# EAGLE design PSU-triple-voltage-eagle-6 (EAGLE 6.2)
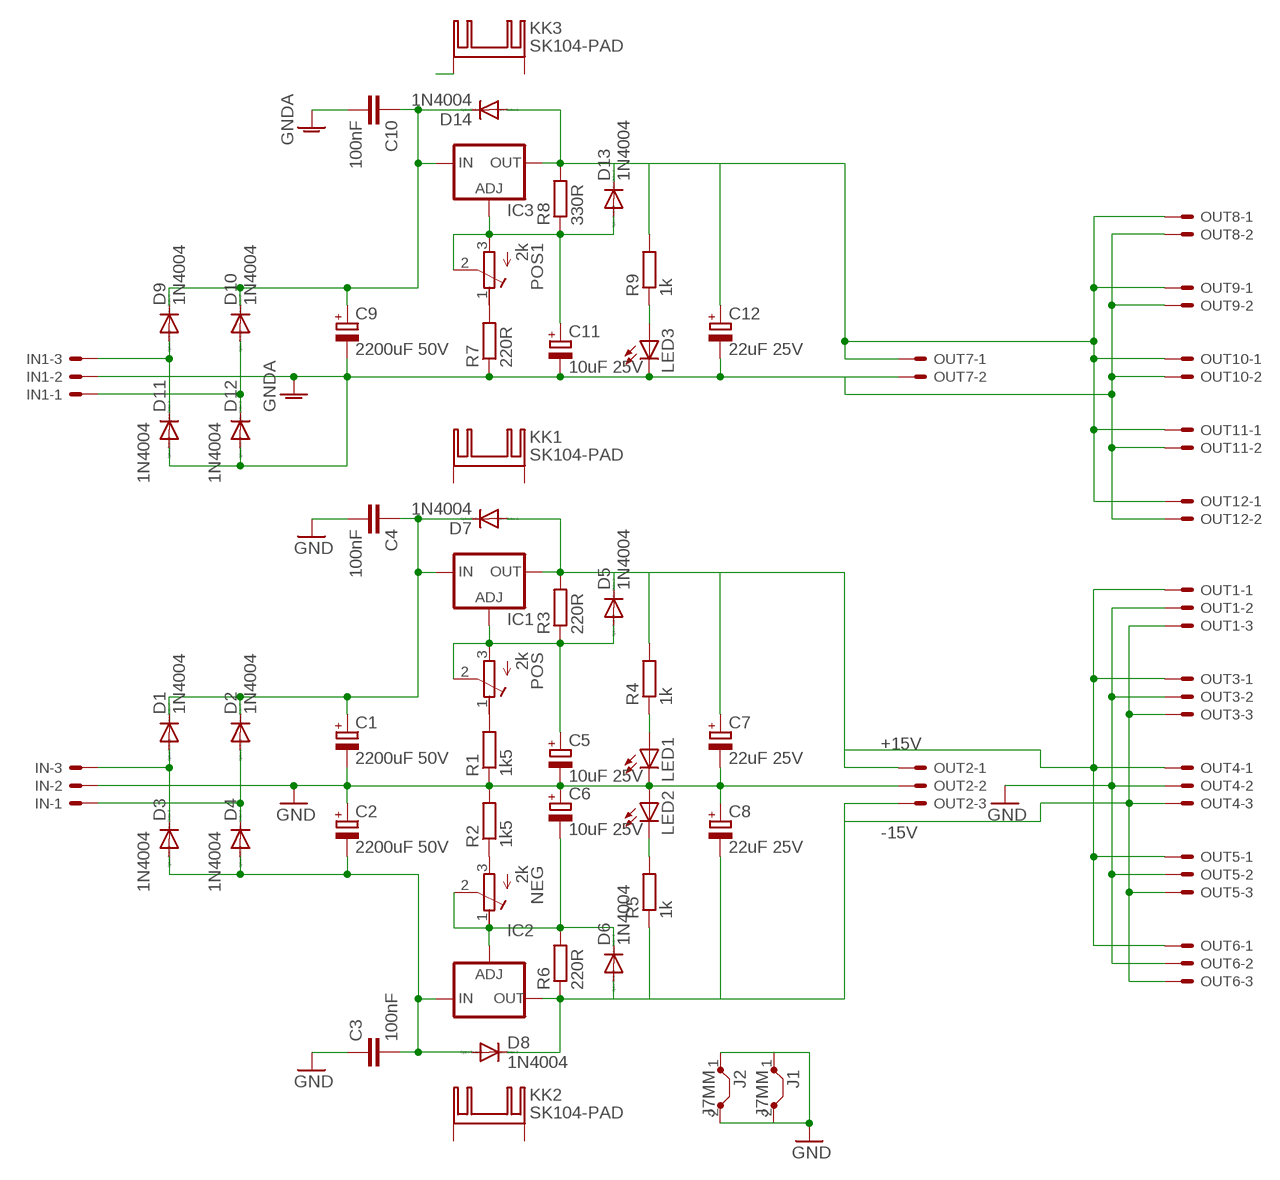
[diagram p0: schematic, sheet 1]

## Parts
C1  2200uF 50V  CPOL-EUE7.5-16  [E7,5-16]
C2  2200uF 50V  CPOL-EUE7.5-16  [E7,5-16]
C3  100nF  C-EU050-025X075  [C050-025X075]
C4  100nF  C-EU050-025X075  [C050-025X075]
C5  10uF 25V  CPOL-EUE2.5-5  [E2,5-5]
C6  10uF 25V  CPOL-EUE2.5-5  [E2,5-5]
C7  22uF 25V  CPOL-EUE2.5-5  [E2,5-5]
C8  22uF 25V  CPOL-EUE2.5-5  [E2,5-5]
C9  2200uF 50V  CPOL-EUE7.5-16  [E7,5-16]
C10  100nF  C-EU050-025X075  [C050-025X075]
C11  10uF 25V  CPOL-EUE2.5-5  [E2,5-5]
C12  22uF 25V  CPOL-EUE2.5-5  [E2,5-5]
D1  1N4004  [DO41-10]
D2  1N4004  [DO41-10]
D3  1N4004  [DO41-10]
D4  1N4004  [DO41-10]
D5  1N4004  [DO41-10]
D6  1N4004  [DO41-10]
D7  1N4004  [DO41-10]
D8  1N4004  [DO41-10]
D9  1N4004  [DO41-10]
D10  1N4004  [DO41-10]
D11  1N4004  [DO41-10]
D12  1N4004  [DO41-10]
D13  1N4004  [DO41-10]
D14  1N4004  [DO41-10]
IC1  LM317TS  [317TS]
IC2  LM337TS  [337TS]
IC3  LM317TS  [317TS]
IN  KK-156-3  [KK-156-3]
IN1  KK-156-3  [KK-156-3]
J1  J7MM  [07]
J2  J7MM  [07]
KK1  SK104-PAD  [SK104-PAD]
KK2  SK104-PAD  [SK104-PAD]
KK3  SK104-PAD  [SK104-PAD]
LED1  LED3MM  [LED3MM]
LED2  LED3MM  [LED3MM]
LED3  LED3MM  [LED3MM]
NEG  2k  R-TRIMMT93YA  [RTRIMT93YA]
OUT1  KK-156-3  [KK-156-3]
OUT2  KK-156-3  [KK-156-3]
OUT3  KK-156-3  [KK-156-3]
OUT4  KK-156-3  [KK-156-3]
OUT5  KK-156-3  [KK-156-3]
OUT6  KK-156-3  [KK-156-3]
OUT7  KK-156-2  [KK-156-2]
OUT8  KK-156-2  [KK-156-2]
OUT9  KK-156-2  [KK-156-2]
OUT10  KK-156-2  [KK-156-2]
OUT11  KK-156-2  [KK-156-2]
OUT12  KK-156-2  [KK-156-2]
POS  2k  R-TRIMMT93YA  [RTRIMT93YA]
POS1  2k  R-TRIMMT93YA  [RTRIMT93YA]
R1  1k5  R-EU_0207/7  [0207/7]
R2  1k5  R-EU_0207/7  [0207/7]
R3  220R  R-EU_0207/7  [0207/7]
R4  1k  R-EU_0207/7  [0207/7]
R5  1k  R-EU_0207/7  [0207/7]
R6  220R  R-EU_0207/7  [0207/7]
R7  220R  R-EU_0207/7  [0207/7]
R8  330R  R-EU_0207/7  [0207/7]
R9  1k  R-EU_0207/7  [0207/7]

## Nets
+5V: C12.+ D13.C D14.A IC3.2(OUT) OUT7.1 OUT8.1 OUT9.1 OUT10.1 OUT11.1 OUT12.1 R8.2 R9.2
+15V: C7.+ D5.C D7.A IC1.2(OUT) OUT1.1 OUT2.1 OUT3.1 OUT4.1 OUT5.1 OUT6.1 R3.2 R4.2
-15V: C8.- D6.A D8.C IC2.3(OUT) OUT1.3 OUT2.3 OUT3.3 OUT4.3 OUT5.3 OUT6.3 R5.1 R6.1
GND: C1.- C2.+ C3.1 C4.2 C5.- C6.+ C7.- C8.+ IN.2 J1.1 J1.2 J2.1 J2.2 LED1.K(C) LED2.A OUT1.2 OUT2.2 OUT3.2 OUT4.2 OUT5.2 OUT6.2 R1.1 R2.2
GNDA: C9.- C10.2 C11.- C12.- D11.A D12.A IN1.2 LED3.K(C) OUT7.2 OUT8.2 OUT9.2 OUT10.2 OUT11.2 OUT12.2 R7.1
N$1: LED3.A R9.1
N$2: POS1.1(E) R7.2
N$3: C11.+ D13.A IC3.1(ADJ) POS1.2(S) POS1.3(A) R8.1
N$5: LED1.A R4.1
N$6: C9.+ C10.1 D9.C D10.C D14.C IC3.3(IN)
N$7: LED2.K(C) R5.2
N$8: D10.A D12.C IN1.1
N$9: POS.1(E) R1.2
N$10: C5.+ D5.A IC1.1(ADJ) POS.2(S) POS.3(A) R3.1
N$11: NEG.3(A) R2.1
N$12: C6.- D6.C IC2.1(ADJ) NEG.1(E) NEG.2(S) R6.2
N$13: C2.- C3.2 D3.A D4.A D8.A IC2.2(IN)
N$14: D9.A D11.C IN1.3
N$15: KK3.K1(K)
N$16: C1.+ C4.1 D1.C D2.C D7.C IC1.3(IN)
N$21: D2.A D4.C IN.1
N$22: D1.A D3.C IN.3
Unconnected: KK1.K1(K) KK1.K2(K) KK2.K1(K) KK2.K2(K) KK3.K2(K)

## Library data of the parts
C1 C2 C5-C9 C11 C12 = resistor:CPOL-EU: POLARIZED CAPACITOR, European symbol
C3 C4 C10 = resistor:C-EU: CAPACITOR, European symbol
D1-D14 = diode:1N4004: DIODE general purpose rectifier, 1 A
IC1 IC3 = v-reg:LM317TS: VOLTAGE REGULATOR
IC2 = v-reg:LM337TS: VOLTAGE REGULATOR
IN IN1 OUT1-OUT6 = con-molex:KK-156-3: KK 156 HEADER Source: http://www.molex.com/pdm_docs/sd/026604100_sd.pdf; OC_FARNELL: unknown; OC_NEWARK: unknown
J1 J2 = jumper:J: Bridge
KK1-KK3 = heatsink:SK104-PAD: HEATSINK manufacturer Fischer/distributor Buerklin
LED1-LED3 = led:LED: LED OSRAM: - CHIPLED LG R971, LG N971, LY N971, LG Q971, LY Q971, LO R971, LY R971 LH N974, LH R974 LS Q976, LO Q976, LY Q976 LO Q996 - Hyper CHIPLED LW Q18S LB Q993, LB Q99A, LB R99A - SideLED LS A670, LO A670, LY A670, LG A670, LP A670 LB A673, LV A673, LT A673, LW A673 LH A674 LY A675 LS A676, LA A676, LO A676, LY A676, LW A676 LS A679, LY A679, LG A679 - Hyper Micro SIDELED® LS Y876, LA Y876, LO Y876, LY Y876 LT Y87S - SmartLED LW L88C, LW L88S LB L89C, LB L89S, LG L890 LS L89K, LO L89K, LY L89K LS L896, LA L896, LO L896, LY L896 - TOPLED LS T670, LO T670, LY T670, LG T670, LP T670 LSG T670, LSP T670, LSY T670, LOP T670, LYG T670 LG T671, LOG T671, LSG T671 LB T673, LV T673, LT T673, LW T673 LH T674 LS T676, LA T676, LO T676, LY T676, LB T676, LH T676, LSB T676, LW T676 LB T67C, LV T67C, LT T67C, LS T67K, LO T67K, LY T67K, LW E67C LS E67B, LA E67B, LO E67B, LY E67B, LB E67C, LV E67C, LT E67C LW T67C LS T679, LY T679, LG T679 LS T770, LO T770, LY T770, LG T770, LP T770 LB T773, LV T773, LT T773, LW T773 LH T774 LS E675, LA E675, LY E675, LS T675 LS T776, LA T776, LO T776, LY T776, LB T776 LHGB T686 LT T68C, LB T68C - Hyper Mini TOPLED® LB M676 - Mini TOPLED Santana® LG M470 LS M47K, LO M47K, LY M47K Source: http://www.osram.convergy.de LUXEON: - LUMILED® LXK2-PW12-R00, LXK2-PW12-S00, LXK2-PW14-U00, LXK2-PW14-V00 LXK2-PM12-R00, LXK2-PM12-S00, LXK2-PM14-U00 LXK2-PE12-Q00, LXK2-PE12-R00, LXK2-PE12-S00, LXK2-PE14-T00, LXK2-PE14-U00 LXK2-PB12-K00, LXK2-PB12-L00, LXK2-PB12-M00, LXK2-PB14-N00, LXK2-PB14-P00, LXK2-PB14-Q00 LXK2-PR12-L00, LXK2-PR12-M00, LXK2-PR14-Q00, LXK2-PR14-R00 LXK2-PD12-Q00, LXK2-PD12-R00, LXK2-PD12-S00 LXK2-PH12-R00, LXK2-PH12-S00 LXK2-PL12-P00, LXK2-PL12-Q00, LXK2-PL12-R00 Source: www.luxeon.com KINGBRIGHT: KA-3528ASYC Source: www.kingbright.com
NEG POS POS1 = resistor:R-TRIMM: Trimm resistor
OUT7-OUT12 = con-molex:KK-156-2: KK 156 HEADER Source: http://www.molex.com/pdm_docs/sd/026604100_sd.pdf; OC_FARNELL: unknown; OC_NEWARK: unknown
R1-R9 = resistor:R-EU_: RESISTOR, European symbol

## Board
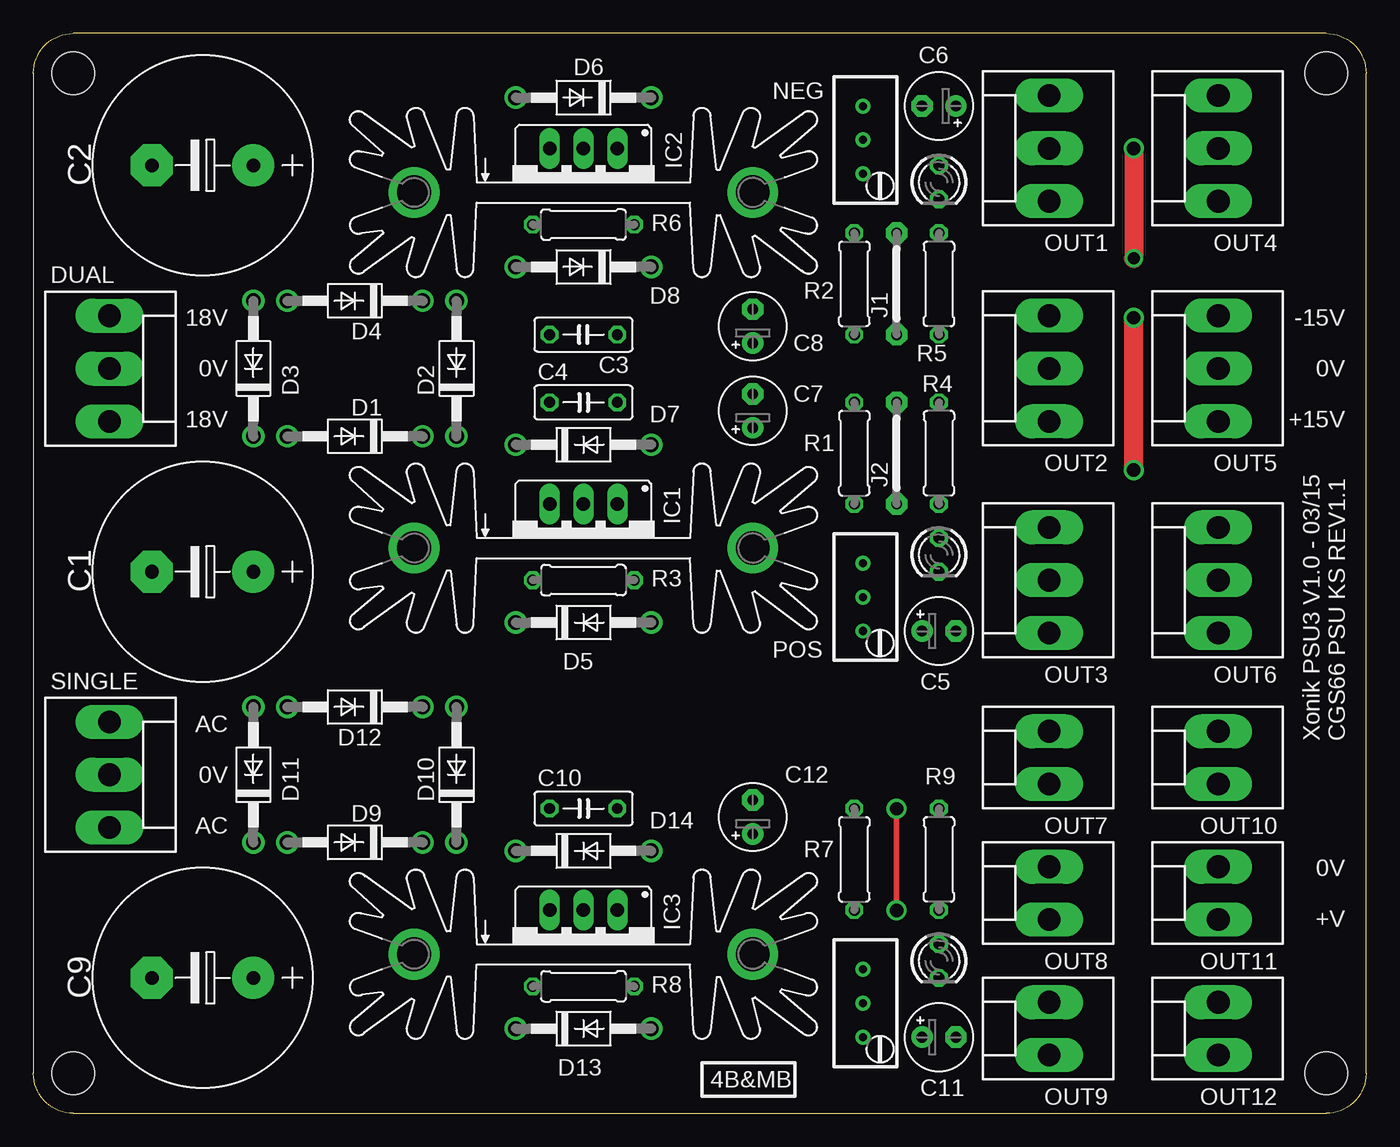
[diagram p1: board, top side]
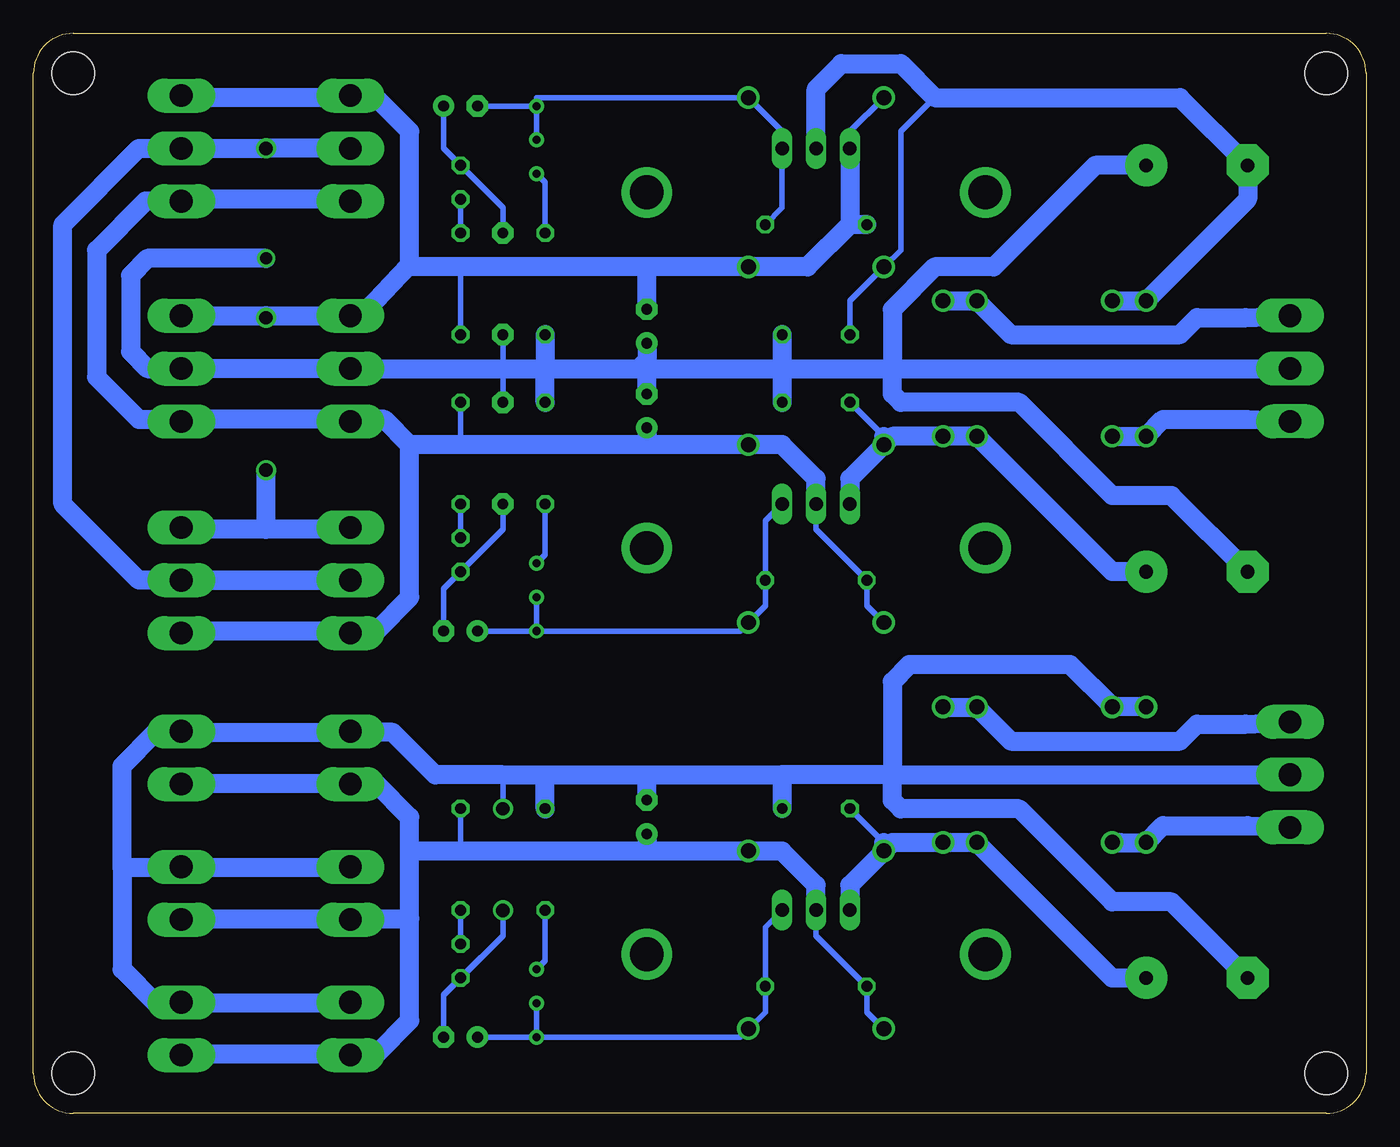
[diagram p2: board, bottom side, seen from below]

Size 100 x 81 mm. Coordinates in mm from the lower left corner, seen from the top.
Outline: 3,0 97,0 arc90 100,3 100,78 arc90 97,81 3,81 arc90 0,78 0,3 arc90 3,0
Copper layers (1*16): Top 0.035mm / dielectric 1.5mm / Bottom 0.035mm
Design rules: minimum track width 10mil, minimum drill 24mil, track to track 8mil, track to pad 8mil, pad to pad 8mil, via to via 8mil, smd to smd 8mil, copper to edge 40mil, drill to drill 8mil, minimum pad ring 10mil, minimum via ring 8mil, stop-mask expansion 4mil, vias tented up to drill 0mil, thermal gap 10mil
Holes 3.2 mm at 3,78 97,3 3,3 97,78

### Footprints (pad centres in the part's own frame; a part is rotated, then mirrored left to right if it is on the bottom)
E7,5-16 = drill 1.016 pad 3.15: + -3.81,0 | drill 1.016 pad 3.15 octagon: - 3.81,0
C050-025X075 = drill 0.813 octagon: 1 -2.54,0; 2 2.54,0
E2,5-5 = drill 0.813 pad 1.6: + -1.27,0 | drill 0.813 pad 1.6 octagon: - 1.27,0
DO41-10 = drill 1.118: A 5.08,0; C -5.08,0
317TS = drill 1.016 long: 1 -2.54,-2.54; 2 0,-2.54; 3 2.54,-2.54
337TS = drill 1.016 long: 1 -2.54,-2.54; 2 0,-2.54; 3 2.54,-2.54
KK-156-3 = drill 1.7 pad 2.184 long: 1 -3.96,0; 2 0,0; 3 3.96,0
07 = drill 0.813 pad 1.6 octagon: 1 -3.81,0; 2 3.81,0
SK104-PAD = drill 2.54 pad 3.81: K1 -12.7,-0.762; K2 12.7,-0.762
LED3MM = drill 0.813 octagon: A -1.27,0; K 1.27,0
RTRIMT93YA = drill 0.61: 1 0,-2.54; 2 0,0; 3 0,2.54
KK-156-2 = drill 1.7 pad 2.184 long: 1 -1.98,0; 2 1.98,0
0207/7 = drill 0.813 octagon: 1 -3.81,0; 2 3.81,0

### Placement (x,y rotation side)
C1  12.7,40.62 180 top
C2  12.7,71.1 180 top
C3  41.27,58.4 180 top
C4  41.27,53.32 0 top
C5  67.94,36.17 0 top
C6  67.94,75.55 180 top
C7  53.98,52.69 90 top
C8  53.98,59.03 90 top
C9  12.7,10.16 180 top
C10  41.27,22.86 0 top
C11  67.94,5.71 0 top
C12  53.98,22.23 90 top
D1  24.13,50.78 180 top
D2  31.75,55.86 90 top
D3  16.51,55.86 90 top
D4  24.13,60.94 180 top
D5  41.27,36.81 0 top
D6  41.27,76.18 180 top
D7  41.27,50.15 0 top
D8  41.27,63.48 180 top
D9  24.13,20.32 180 top
D10  31.75,25.4 90 top
D11  16.51,25.4 90 top
D12  24.13,30.48 180 top
D13  41.27,6.35 0 top
D14  41.27,19.68 0 top
IC1  41.27,43.16 180 top
IC2  41.27,69.83 180 top
IC3  41.27,12.7 180 top
IN  5.71,55.86 270 top
IN1  5.71,25.4 270 top
J1  64.77,62.21 90 top
J2  64.77,49.51 90 top
KK1  41.27,43.16 0 top
KK2  41.27,69.83 0 top
KK3  41.27,12.7 0 top
LED1  67.94,41.89 270 top
LED2  67.94,69.83 270 top
LED3  67.94,11.43 270 top
NEG  62.23,73 180 top
OUT1  76.2,72.37 90 top
OUT2  76.2,55.86 90 top
OUT3  76.2,39.98 90 top
OUT4  88.9,72.37 90 top
OUT5  88.9,55.86 90 top
OUT6  88.9,39.98 90 top
OUT7  76.2,26.67 90 top
OUT8  76.2,16.51 90 top
OUT9  76.2,6.35 90 top
OUT10  88.9,26.67 90 top
OUT11  88.9,16.51 90 top
OUT12  88.9,6.35 90 top
POS  62.23,38.72 180 top
POS1  62.23,8.26 180 top
R1  61.59,49.51 270 top
R2  61.59,62.21 270 top
R3  41.27,39.98 180 top
R4  67.94,49.51 90 top
R5  67.94,62.21 90 top
R6  41.27,66.66 0 top
R7  61.59,19.05 270 top
R8  41.27,9.53 180 top
R9  67.94,19.05 90 top

### Tracks (layer width: path | path; a pad name or v marks a point on that pad's centre or on a via)
+5V
  Bottom 0.406: 36.2,6.33 36.22,6.35 | 37.48,9.53 37.47,9.51 37.47,7.6 36.22,6.35 | 37.48,9.53 41.27,13.31 41.27,15.22 | R9.2 67.94,19.66 | D14.A 46.97,19.68 46.99,19.66 | R8.2 37.48,9.53 | D13.C 36.22,6.35 | C12.+ 53.98,19.66
  Bottom 1.422: 41.27,15.22 IC3.2 41.27,17.12 43.81,19.66 46.99,19.66 53.98,19.66 | 53.98,20.93 53.98,19.66 | 53.98,19.66 67.94,19.66 71.75,19.66 | 71.75,19.66 71.75,22.23 74.3,24.77 76.12,24.77 OUT7.1 76.28,24.77 88.9,24.77 OUT10.1 | 71.75,14.61 71.75,6.96 74.3,4.42 75.58,4.42 | 71.75,14.61 71.75,19.66 | 76.2,4.28 76.03,4.45 75.56,4.45 75.58,4.42 | 76.14,4.42 88.75,4.42 88.9,4.28 89.07,4.45 90.17,4.45 90.09,4.37 OUT12.1 | 71.75,14.61 71.83,14.53 71.91,14.61 76.2,14.61 OUT8.1 76.28,14.61 88.9,14.61 OUT11.1 | 76.14,4.42 OUT9.1 | 76.14,4.42 75.58,4.42
+15V
  Bottom 0.406: D5.C 37.47,38.08 R3.2 41.27,43.8 IC1.2 | R4.2 67.94,50.15
  Bottom 1.422: IC1.2 41.27,47.6 43.81,50.15 D7.A 53.98,50.15 | C7.+ 53.98,50.15 | 53.98,50.15 67.94,50.15 71.75,50.15 | 71.75,50.15 73.66,52.05 75.56,52.05 OUT2.1 76.69,51.9 76.83,52.05 89.05,52.05 | 71.75,50.15 71.75,38.72 74.3,36.17 76.05,36.17 OUT3.1 76.69,36.02 76.83,36.17 88.75,36.17 OUT6.1 | OUT1.1 76.69,68.41 76.83,68.56 88.75,68.56 OUT4.1 91.59,68.41 95.25,64.75 95.25,55.23 92.08,52.05 89.05,52.05 | 89.05,52.05 OUT5.1
-15V  (via drill 1)
  Top 1.422: v82.55,48.24 v82.55,59.67
  Bottom 0.406: D6.A 38.73,73.64 IC2.3 | R5.1 67.94,63.48
  Bottom 1.422: IC2.3 38.73,66.66 | 38.73,66.66 41.91,63.48 D8.C 53.98,63.48 | R6.1 38.73,66.66 | C8.- 53.98,63.48 | 53.98,63.48 67.94,63.48 71.75,63.48 | 82.55,59.82 OUT5.3 89.39,60.3 | 82.55,59.82 OUT2.3 75.42,59.82 74.93,60.3 71.91,63.48 71.75,63.48 | OUT3.3 76.69,43.95 76.83,43.8 82.55,43.8 | 82.55,43.8 88.75,43.8 OUT6.3 | OUT1.3 76.69,76.33 76.83,76.18 | 76.83,76.18 88.75,76.18 OUT4.3 | 71.75,63.48 71.75,73.64 74.3,76.18 76.83,76.18 | 82.55,43.8 v82.55,48.24 | v82.55,59.67 82.55,59.82
GND  (via drill 0.9, 1)
  Top 0.406: J1.2 J1.1 | J2.1 J2.2
  Top 1.422: v82.55,72.37 v82.55,64.11
  Bottom 0.406: C6.+ 69.22,72.37 LED2.A 64.77,67.92 J1.2 | C5.- 69.22,39.35 LED1.K 64.77,43.8 J2.1 | J1.1 64.77,55.86 J2.2
  Bottom 1.422: 61.59,55.86 64.77,55.86 OUT2.2 OUT5.2 91.44,55.86 92.71,57.13 92.71,62.84 91.44,64.11 v82.55,64.11 | 61.59,55.86 54.61,55.86 | 54.61,55.86 53.98,55.86 | 53.98,55.86 43.81,55.86 | 43.81,55.86 35.56,55.86 | 35.56,55.86 IN.2 | C1.- 14.61,46.34 19.05,46.34 26.04,53.32 34.92,53.32 35.56,53.95 35.56,55.86 | C2.+ 20.32,71.1 27.94,63.48 32.38,63.48 35.56,60.3 35.56,55.86 | C3.1 43.81,55.86 | 43.81,55.86 C4.2 | R2.2 61.59,55.86 | R1.1 61.59,55.86 | C8.+ 53.98,56.49 54.61,55.86 | C7.- 53.98,55.86 | OUT6.2 OUT3.2 92.08,39.98 97.79,45.7 97.79,66.66 92.08,72.37 OUT4.2 v82.55,72.37 OUT1.2
GNDA  (via drill 1)
  Top 0.406: v64.77,15.22 v64.77,22.84
  Bottom 0.406: 69.22,5.7 C11.- 69.22,8.87 | v64.77,22.84 64.77,25.38 | 64.77,13.34 v64.77,15.22 64.77,15.24 | 64.77,13.34 64.77,13.31 69.22,8.87 | 69.22,8.87 69.22,8.89 LED3.K | C9.- 8.91,10.16 9.54,10.79 | IN1.2 7.6,25.4 7.62,25.38 | 67.31,10.79 LED3.K | LED3.K 64.77,13.34
  Bottom 1.422: 61.59,25.38 64.77,25.38 69.85,25.38 69.85,25.4 73.03,28.57 76.12,28.57 OUT7.2 76.28,28.57 88.9,28.57 OUT10.2 88.97,28.57 90.81,28.57 93.34,26.04 93.34,18.41 | 61.59,25.38 53.98,25.38 | 53.98,25.38 43.8,25.38 | 35.56,25.38 7.62,25.38 5.71,25.38 | 8.89,10.14 9.54,10.79 14.61,15.86 19.05,15.86 26.04,22.84 34.92,22.84 35.56,23.48 35.56,25.38 | 61.59,22.84 R7.1 61.59,25.38 | 53.98,23.48 C12.- 53.98,25.38 | D11.A D12.A 22.23,33.66 34.29,33.66 35.56,32.38 35.56,25.38 | 93.34,18.41 88.9,18.41 OUT11.2 88.83,18.41 76.83,18.41 76.76,18.49 OUT8.2 | 93.34,18.41 93.34,10.79 90.81,8.26 88.97,8.26 OUT12.2 88.83,8.26 76.83,8.26 76.76,8.33 OUT9.2 | 35.56,25.38 43.8,25.38 | 43.8,25.38 43.81,25.4 C10.2
N$1
  Bottom 0.406: R9.1 LED3.A
N$2
  Bottom 0.406: R7.2 61.59,11.43 POS1.1
N$3
  Bottom 0.406: 46.35,6.33 45.09,7.6 R8.1 45.09,13.95 43.81,15.22 43.84,15.22 | 62.23,5.7 46.99,5.7 46.35,6.33 | 62.23,5.7 POS1.3 POS1.2 | 62.23,5.7 66.06,5.7 | 43.84,15.22 44.45,14.61 | 43.84,15.22 IC3.1 | D13.A 46.35,6.33 | 66.67,5.7 66.06,5.7 | 66.06,5.7 66.04,5.71 C11.+
N$5
  Bottom 0.406: R4.1 LED1.A
N$6
  Bottom 0.406: 36.2,20.3 38.73,22.84 C10.1 | C9.+ 19.03,10.16 19.05,10.14 | 29.21,20.3 30.46,20.3 30.48,20.32 D9.C | 36.2,19.66 36.22,19.66 | 36.22,19.66 37.47,18.41 | 36.22,19.66 D14.C
  Bottom 1.422: 16.51,10.14 19.05,10.14 29.21,20.3 31.73,20.3 | 31.73,20.3 35.56,20.3 36.2,19.66 | 36.2,20.3 D14.C 36.2,19.66 | 36.2,19.66 38.73,17.12 IC3.3 38.73,15.22 | 31.73,20.3 D10.C
N$7
  Bottom 0.406: R5.2 LED2.K
N$8
  Bottom 0.406: IN1.1 7.52,29.36 7.62,29.25 | 29.21,30.46 29.82,30.46 29.84,30.48 D12.C | 31.75,30.46 30.5,30.46 30.48,30.48 D10.A
  Bottom 1.422: 31.75,30.46 29.21,30.46 26.67,27.92 13.97,27.92 12.7,29.19 9.04,29.19 7.62,29.25 5.71,29.34
N$9
  Bottom 0.406: R1.2 61.59,41.89 POS.1
N$10
  Bottom 0.406: IC1.1 45.09,44.43 R3.1 45.09,38.08 D5.A 46.99,36.17 POS.3 | POS.3 POS.2 | POS.3 C5.+
N$11
  Bottom 0.406: R2.1 61.59,69.83 NEG.3
N$12
  Bottom 0.406: R6.2 43.81,67.92 IC2.1 43.81,73.64 D6.C 62.23,76.18 NEG.1 | NEG.1 NEG.2 | NEG.1 C6.-
N$13
  Bottom 0.406: 32.38,76.18 34.92,73.64 34.92,64.75 D8.A 38.73,60.94 C3.2
  Bottom 1.422: D4.A D3.A 8.89,68.56 C2.- 13.97,76.18 32.38,76.18 34.92,78.72 39.37,78.72 41.27,76.81 IC2.2
N$14
  Bottom 0.406: D9.A 18.43,20.32 18.41,20.3 | 16.51,20.3 17.12,20.3 17.14,20.32 D11.C | IN1.3 6.35,21.44 6.36,21.45
  Bottom 1.422: 19.05,20.3 18.41,20.3 16.51,20.3 15.24,21.57 8.89,21.57 6.36,21.45 5.71,21.42
N$16
  Bottom 0.406: C4.1 36.2,50.78
  Bottom 1.422: C1.+ 19.05,40.62 D1.C D2.C 35.56,50.78 D7.C | 36.2,50.78 D7.C | D7.C 38.73,47.6 IC1.3
N$21
  Bottom 1.422: D2.A D4.C 26.67,58.4 13.97,58.4 12.7,59.67 9.04,59.67 IN.1
N$22
  Bottom 1.422: D1.A D3.C 15.24,52.05 8.89,52.05 IN.3

### Text on the board
tPlace: 4B&MB
tNames: DUAL | 18V | -15V | 0V | 0V | 18V | +15V | SINGLE | AC | Xonik PSU3 V1.0 - 03/15 | CGS66 PSU KS REV1.1 | 0V | AC | 0V | +V